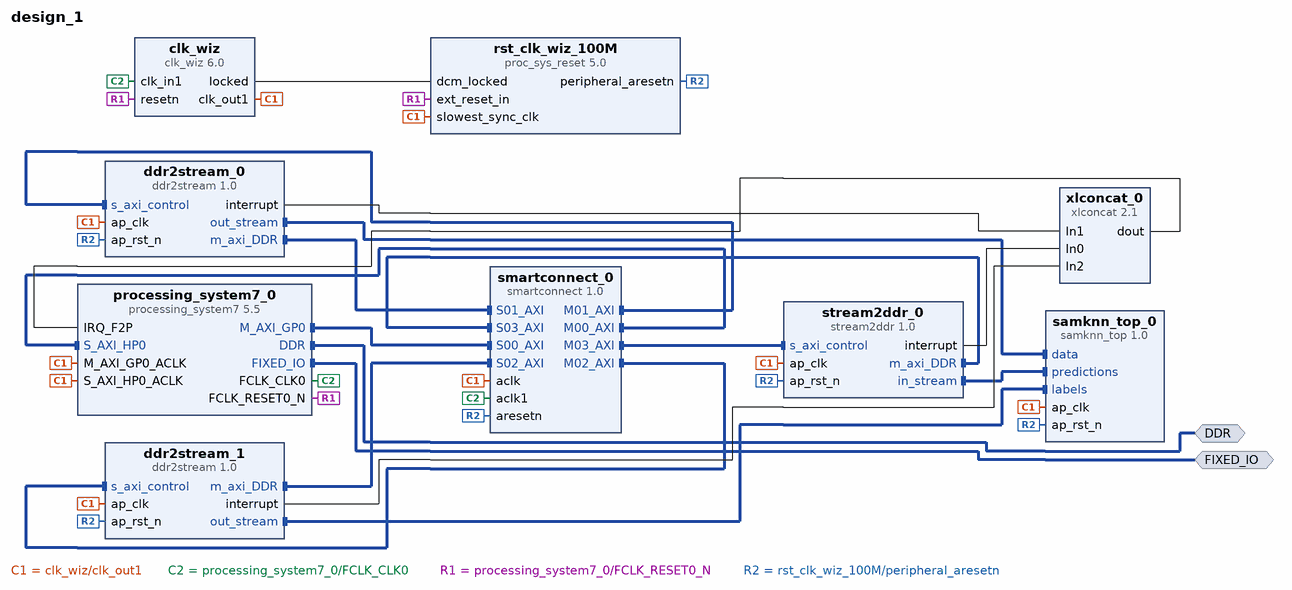
[diagram p0: block diagram of the top level]
# Vivado block design design_1, xc7z020clg400-1, Vivado 2023.2
create_bd_design design_1

create_bd_intf_port -mode Master -vlnv xilinx.com:interface:ddrx_rtl:1.0 DDR
create_bd_intf_port -mode Master -vlnv xilinx.com:display_processing_system7:fixedio_rtl:1.0 FIXED_IO

create_bd_cell -type ip -vlnv xilinx.com:ip:processing_system7:5.5 processing_system7_0
set_property -dict [list \
  CONFIG.PCW_APU_PERIPHERAL_FREQMHZ 666.666666 \
  CONFIG.PCW_ENET0_ENET0_IO {MIO 16 .. 27} \
  CONFIG.PCW_ENET0_GRP_MDIO_ENABLE 1 \
  CONFIG.PCW_ENET0_GRP_MDIO_IO {MIO 52 .. 53} \
  CONFIG.PCW_ENET0_PERIPHERAL_ENABLE 1 \
  CONFIG.PCW_ENET0_RESET_ENABLE 0 \
  CONFIG.PCW_ENET_RESET_ENABLE 1 \
  CONFIG.PCW_ENET_RESET_SELECT {Share reset pin} \
  CONFIG.PCW_FPGA0_PERIPHERAL_FREQMHZ 50 \
  CONFIG.PCW_FPGA1_PERIPHERAL_FREQMHZ 50 \
  CONFIG.PCW_GPIO_MIO_GPIO_ENABLE 1 \
  CONFIG.PCW_GPIO_MIO_GPIO_IO MIO \
  CONFIG.PCW_I2C_RESET_ENABLE 1 \
  CONFIG.PCW_IRQ_F2P_INTR 1 \
  CONFIG.PCW_PERIPHERAL_BOARD_PRESET part0 \
  CONFIG.PCW_PRESET_BANK1_VOLTAGE {LVCMOS 1.8V} \
  CONFIG.PCW_QSPI_GRP_FBCLK_ENABLE 1 \
  CONFIG.PCW_QSPI_GRP_FBCLK_IO {MIO 8} \
  CONFIG.PCW_QSPI_GRP_SINGLE_SS_ENABLE 1 \
  CONFIG.PCW_QSPI_GRP_SINGLE_SS_IO {MIO 1 .. 6} \
  CONFIG.PCW_QSPI_PERIPHERAL_ENABLE 1 \
  CONFIG.PCW_QSPI_QSPI_IO {MIO 1 .. 6} \
  CONFIG.PCW_SD0_GRP_CD_ENABLE 1 \
  CONFIG.PCW_SD0_GRP_CD_IO {MIO 47} \
  CONFIG.PCW_SD0_GRP_WP_ENABLE 0 \
  CONFIG.PCW_SD0_PERIPHERAL_ENABLE 1 \
  CONFIG.PCW_SD0_SD0_IO {MIO 40 .. 45} \
  CONFIG.PCW_SDIO_PERIPHERAL_FREQMHZ 50 \
  CONFIG.PCW_SINGLE_QSPI_DATA_MODE x4 \
  CONFIG.PCW_UART1_PERIPHERAL_ENABLE 1 \
  CONFIG.PCW_UART1_UART1_IO {MIO 48 .. 49} \
  CONFIG.PCW_UART_PERIPHERAL_FREQMHZ 100 \
  CONFIG.PCW_UIPARAM_DDR_FREQ_MHZ 533.333333 \
  CONFIG.PCW_UIPARAM_DDR_MEMORY_TYPE {DDR 3 (Low Voltage)} \
  CONFIG.PCW_UIPARAM_DDR_PARTNO {MT41K256M16 RE-125} \
  CONFIG.PCW_USB0_PERIPHERAL_ENABLE 1 \
  CONFIG.PCW_USB0_RESET_ENABLE 1 \
  CONFIG.PCW_USB0_RESET_IO {MIO 46} \
  CONFIG.PCW_USB0_USB0_IO {MIO 28 .. 39} \
  CONFIG.PCW_USB_RESET_ENABLE 1 \
  CONFIG.PCW_USB_RESET_SELECT {Share reset pin} \
  CONFIG.PCW_USE_FABRIC_INTERRUPT 1 \
  CONFIG.PCW_USE_S_AXI_HP0 1 \
  CONFIG.preset None \
] [get_bd_cells processing_system7_0]
# 509 more settings of processing_system7_0 are not shown: defaults, MIO pin electricals, DDR timing, and values the tool derives
create_bd_cell -type ip -vlnv xilinx.com:ip:smartconnect:1.0 smartconnect_0
set_property -dict {CONFIG.NUM_CLKS 2 CONFIG.NUM_MI 4 CONFIG.NUM_SI 4} [get_bd_cells smartconnect_0]
create_bd_cell -type ip -vlnv xilinx.com:hls:samknn_top:1.0 samknn_top_0
create_bd_cell -type ip -vlnv xilinx.com:hls:ddr2stream:1.0 ddr2stream_1
create_bd_cell -type ip -vlnv xilinx.com:hls:ddr2stream:1.0 ddr2stream_0
create_bd_cell -type ip -vlnv xilinx.com:hls:stream2ddr:1.0 stream2ddr_0
create_bd_cell -type ip -vlnv xilinx.com:ip:clk_wiz:6.0 clk_wiz
set_property -dict [list \
  CONFIG.CLKOUT1_JITTER 162.035 \
  CONFIG.CLKOUT1_REQUESTED_OUT_FREQ 100 \
  CONFIG.MMCM_CLKOUT0_DIVIDE_F 10.000 \
  CONFIG.RESET_PORT resetn \
  CONFIG.RESET_TYPE ACTIVE_LOW \
] [get_bd_cells clk_wiz]
create_bd_cell -type ip -vlnv xilinx.com:ip:proc_sys_reset:5.0 rst_clk_wiz_100M
create_bd_cell -type ip -vlnv xilinx.com:ip:xlconcat:2.1 xlconcat_0
set_property -dict {CONFIG.NUM_PORTS 3} [get_bd_cells xlconcat_0]

# ---- connections ----

connect_bd_intf_net [get_bd_intf_pins ddr2stream_0/m_axi_DDR] [get_bd_intf_pins smartconnect_0/S01_AXI]
connect_bd_intf_net [get_bd_intf_pins ddr2stream_0/out_stream] [get_bd_intf_pins samknn_top_0/data]
connect_bd_intf_net [get_bd_intf_pins ddr2stream_1/m_axi_DDR] [get_bd_intf_pins smartconnect_0/S02_AXI]
connect_bd_intf_net [get_bd_intf_pins ddr2stream_1/out_stream] [get_bd_intf_pins samknn_top_0/labels]
connect_bd_intf_net [get_bd_intf_ports DDR] [get_bd_intf_pins processing_system7_0/DDR]
connect_bd_intf_net [get_bd_intf_ports FIXED_IO] [get_bd_intf_pins processing_system7_0/FIXED_IO]
connect_bd_intf_net [get_bd_intf_pins processing_system7_0/M_AXI_GP0] [get_bd_intf_pins smartconnect_0/S00_AXI]
connect_bd_intf_net [get_bd_intf_pins stream2ddr_0/in_stream] [get_bd_intf_pins samknn_top_0/predictions]
connect_bd_intf_net [get_bd_intf_pins smartconnect_0/M00_AXI] [get_bd_intf_pins processing_system7_0/S_AXI_HP0]
connect_bd_intf_net [get_bd_intf_pins ddr2stream_0/s_axi_control] [get_bd_intf_pins smartconnect_0/M01_AXI]
connect_bd_intf_net [get_bd_intf_pins ddr2stream_1/s_axi_control] [get_bd_intf_pins smartconnect_0/M02_AXI]
connect_bd_intf_net [get_bd_intf_pins stream2ddr_0/s_axi_control] [get_bd_intf_pins smartconnect_0/M03_AXI]
connect_bd_intf_net [get_bd_intf_pins stream2ddr_0/m_axi_DDR] [get_bd_intf_pins smartconnect_0/S03_AXI]
connect_bd_net [get_bd_pins clk_wiz/clk_out1] \
  [get_bd_pins smartconnect_0/aclk] [get_bd_pins rst_clk_wiz_100M/slowest_sync_clk] \
  [get_bd_pins processing_system7_0/M_AXI_GP0_ACLK] [get_bd_pins processing_system7_0/S_AXI_HP0_ACLK] \
  [get_bd_pins ddr2stream_0/ap_clk] [get_bd_pins ddr2stream_1/ap_clk] [get_bd_pins stream2ddr_0/ap_clk] \
  [get_bd_pins samknn_top_0/ap_clk]
connect_bd_net [get_bd_pins clk_wiz/locked] [get_bd_pins rst_clk_wiz_100M/dcm_locked]
connect_bd_net [get_bd_pins ddr2stream_0/interrupt] [get_bd_pins xlconcat_0/In1]
connect_bd_net [get_bd_pins ddr2stream_1/interrupt] [get_bd_pins xlconcat_0/In2]
connect_bd_net [get_bd_pins processing_system7_0/FCLK_CLK0] [get_bd_pins smartconnect_0/aclk1] [get_bd_pins clk_wiz/clk_in1]
connect_bd_net [get_bd_pins processing_system7_0/FCLK_RESET0_N] [get_bd_pins rst_clk_wiz_100M/ext_reset_in] [get_bd_pins clk_wiz/resetn]
connect_bd_net [get_bd_pins rst_clk_wiz_100M/peripheral_aresetn] \
  [get_bd_pins smartconnect_0/aresetn] [get_bd_pins ddr2stream_0/ap_rst_n] [get_bd_pins ddr2stream_1/ap_rst_n] \
  [get_bd_pins stream2ddr_0/ap_rst_n] [get_bd_pins samknn_top_0/ap_rst_n]
connect_bd_net [get_bd_pins stream2ddr_0/interrupt] [get_bd_pins xlconcat_0/In0]
connect_bd_net [get_bd_pins xlconcat_0/dout] [get_bd_pins processing_system7_0/IRQ_F2P]

# ---- address map ----
assign_bd_address -offset 0x0000000000000000 -range 1G -target_address_space [get_bd_addr_spaces ddr2stream_0/Data_m_axi_DDR] [get_bd_addr_segs processing_system7_0/S_AXI_HP0/HP0_DDR_LOWOCM]
exclude_bd_addr_seg -offset 0x0000000000000000 -range 64K -target_address_space [get_bd_addr_spaces ddr2stream_0/Data_m_axi_DDR] [get_bd_addr_segs stream2ddr_0/s_axi_control/Reg]
exclude_bd_addr_seg -offset 0x0000000000010000 -range 64K -target_address_space [get_bd_addr_spaces ddr2stream_0/Data_m_axi_DDR] [get_bd_addr_segs ddr2stream_1/s_axi_control/Reg]
exclude_bd_addr_seg -offset 0x0000000000020000 -range 64K -target_address_space [get_bd_addr_spaces ddr2stream_0/Data_m_axi_DDR] [get_bd_addr_segs ddr2stream_0/s_axi_control/Reg]
assign_bd_address -offset 0x0000000000000000 -range 1G -target_address_space [get_bd_addr_spaces ddr2stream_1/Data_m_axi_DDR] [get_bd_addr_segs processing_system7_0/S_AXI_HP0/HP0_DDR_LOWOCM]
exclude_bd_addr_seg -offset 0x0000000000000000 -range 64K -target_address_space [get_bd_addr_spaces ddr2stream_1/Data_m_axi_DDR] [get_bd_addr_segs stream2ddr_0/s_axi_control/Reg]
exclude_bd_addr_seg -offset 0x0000000000010000 -range 64K -target_address_space [get_bd_addr_spaces ddr2stream_1/Data_m_axi_DDR] [get_bd_addr_segs ddr2stream_1/s_axi_control/Reg]
exclude_bd_addr_seg -offset 0x0000000000020000 -range 64K -target_address_space [get_bd_addr_spaces ddr2stream_1/Data_m_axi_DDR] [get_bd_addr_segs ddr2stream_0/s_axi_control/Reg]
assign_bd_address -offset 0x40000000 -range 64K -target_address_space [get_bd_addr_spaces processing_system7_0/Data] [get_bd_addr_segs ddr2stream_0/s_axi_control/Reg]
assign_bd_address -offset 0x40010000 -range 64K -target_address_space [get_bd_addr_spaces processing_system7_0/Data] [get_bd_addr_segs ddr2stream_1/s_axi_control/Reg]
assign_bd_address -offset 0x40020000 -range 64K -target_address_space [get_bd_addr_spaces processing_system7_0/Data] [get_bd_addr_segs stream2ddr_0/s_axi_control/Reg]
exclude_bd_addr_seg -offset 0x00000000 -range 1G -target_address_space [get_bd_addr_spaces processing_system7_0/Data] [get_bd_addr_segs processing_system7_0/S_AXI_HP0/HP0_DDR_LOWOCM]
assign_bd_address -offset 0x0000000000000000 -range 1G -target_address_space [get_bd_addr_spaces stream2ddr_0/Data_m_axi_DDR] [get_bd_addr_segs processing_system7_0/S_AXI_HP0/HP0_DDR_LOWOCM]
exclude_bd_addr_seg -offset 0x0000000000000000 -range 64K -target_address_space [get_bd_addr_spaces stream2ddr_0/Data_m_axi_DDR] [get_bd_addr_segs stream2ddr_0/s_axi_control/Reg]
exclude_bd_addr_seg -offset 0x0000000000010000 -range 64K -target_address_space [get_bd_addr_spaces stream2ddr_0/Data_m_axi_DDR] [get_bd_addr_segs ddr2stream_1/s_axi_control/Reg]
exclude_bd_addr_seg -offset 0x0000000000020000 -range 64K -target_address_space [get_bd_addr_spaces stream2ddr_0/Data_m_axi_DDR] [get_bd_addr_segs ddr2stream_0/s_axi_control/Reg]

validate_bd_design
save_bd_design
